# Altium project eBug2014-Parallella-Carrier-H.PrjPcb
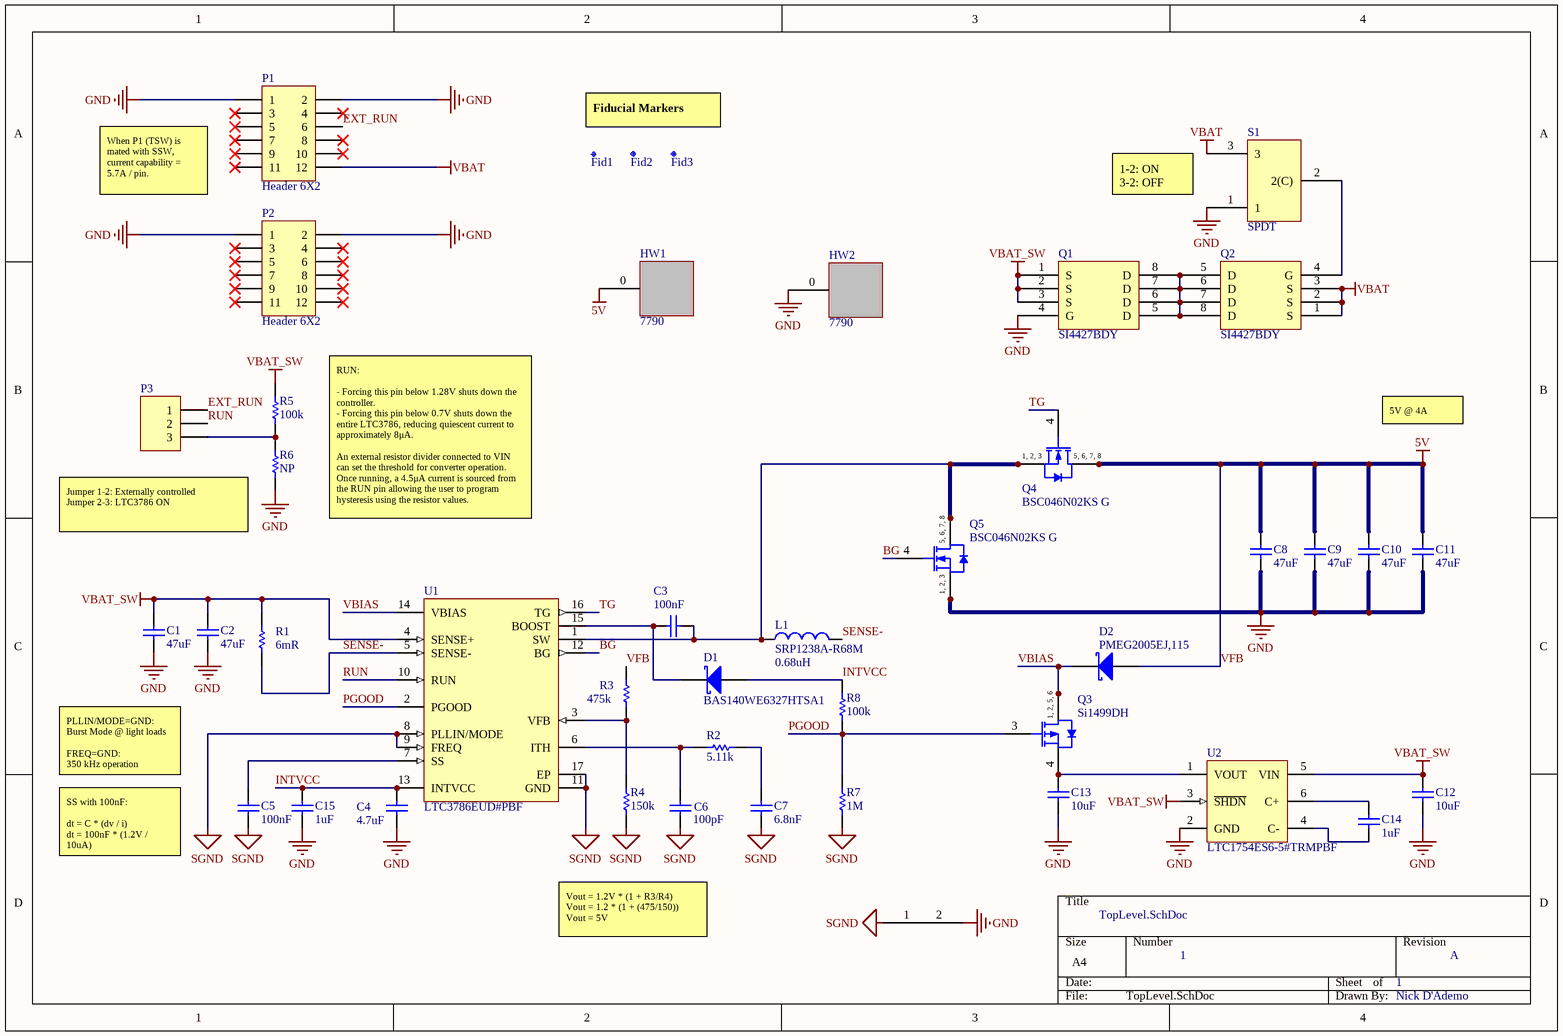
[diagram p0: TopLevel.SchDoc]
1 sheet, 43 parts. Net scope: global (net labels, ports and power ports of the same name join across sheets).
Board file: PCB.PcbDoc

## Sheet TopLevel.SchDoc
size A4; DrawnBy: Nick D'Ademo; DocumentNumber: 1; Revision: A; SheetNumber: 1; SheetTotal: 1

### Parts
C1  value 47uF  [CAPC3225N]  (hidden comment: Cap)
C2  value 47uF  [CAPC3225N]  (hidden comment: Cap)
C3  value 100nF  [CAPC1005N]  (hidden comment: Cap)
C4  value 4.7uF  [CAPC1005N]  (hidden comment: Cap)
C5  value 100nF  [CAPC1005N]  (hidden comment: Cap)
C6  value 100pF  [CAPC1005N]  (hidden comment: Cap)
C7  value 6.8nF  [CAPC1005N]  (hidden comment: Cap)
C8  value 47uF  [CAPC3225N]  (hidden comment: Cap)
C9  value 47uF  [CAPC3225N]  (hidden comment: Cap)
C10  value 47uF  [CAPC3225N]  (hidden comment: Cap)
C11  value 47uF  [CAPC3225N]  (hidden comment: Cap)
C12  value 10uF  [CAPC1005N]  (hidden comment: Cap)
C13  value 10uF  [CAPC1005N]  (hidden comment: Cap)
C14  value 1uF  [CAPC1005N]  (hidden comment: Cap)
C15  value 1uF  [CAPC1005N]  (hidden comment: Cap)
D1  BAS140WE6327HTSA1  [SOD323]
D2  PMEG2005EJ,115  [SOD323F]
Fid1  Fiducial mark  [Fiducial_BOTTOM]  (value not drawn)  (no BOM)
Fid2  Fiducial mark  [Fiducial_BOTTOM]  (value not drawn)  (no BOM)
Fid3  Fiducial mark  [Fiducial_BOTTOM]  (value not drawn)  (no BOM)
HW1  7790  [7790]
HW2  7790  [7790]
L1  SRP1238A-R68M  value 0.68uH  [SRP1238A]
NT1  NETTIE1  [NETTIE1]  (value not drawn)  (net tie, no BOM)
P1  Header 6X2  [TSW-106-05-G-D]
P2  Header 6X2  [TSW-106-05-G-D]
P3  (no value)  [TSW-103-05-T-S]
Q1  SI4427BDY  [SOIC127P600-8AN]
Q2  SI4427BDY  [SOIC127P600-8AN]
Q3  Si1499DH  [SOT363-6N]
Q4  BSC046N02KS G  [INF-PG-TDSON-8-1_V]
Q5  BSC046N02KS G  [INF-PG-TDSON-8-1_V]
R1  value 6mR  [RESC2012N]  (hidden comment: Res1)
R2  value 5.11k  [RESC1005N]  (hidden comment: Res1)
R3  value 475k  [RESC1005N]  (hidden comment: Res1)
R4  value 150k  [RESC1005N]  (hidden comment: Res1)
R5  value 100k  [RESC1005N]  (hidden comment: Res1)
R6  value NP  [RESC1005N]  (hidden comment: Res1)  (no BOM)
R7  value 1M  [RESC1005N]  (hidden comment: Res1)
R8  value 100k  [RESC1005N]  (hidden comment: Res1)
S1  SPDT  [CL-SB-12B-11T]
U1  LTC3786EUD#PBF  [LT-UD-16_N]
U2  LTC1754ES6-5#TRMPBF  [LT-S6-6-SOT-23_N]

### Nets
5V: C8.1 C9.1 C10.1 C11.1 D2.1(A) HW1.0 Q4.5(DRAIN) Q4.6(DRAIN) Q4.7(DRAIN) Q4.8(DRAIN) R3.1  [also labelled VFB]
GND: C1.2 C2.2 C4.2 C8.2 C9.2 C10.2 C11.2 C12.2 C13.2 C15.2 HW2.0 NT1.2 P1.1 P1.2 P2.1 P2.2 Q1.4(G) Q5.1(SOURCE) Q5.2(SOURCE) Q5.3(SOURCE) R6.2 S1.1 U2.2(GND)
SGND: C5.1 C6.2 C7.2 NT1.1 R4.2 R7.2 U1.8(PLLIN/MODE) U1.9(FREQ) U1.11(GND) U1.17(EP)
VBAT: P1.12 Q2.1(S) Q2.2(S) Q2.3(S) S1.3
VBAT_SW: C1.1 C2.1 C12.1 Q1.1(S) Q1.2(S) Q1.3(S) R1.2 R5.1 U1.4(SENSE+) U2.3(~{SHDN}) U2.5(VIN)
BG: Q5.4(GATE) U1.12(BG)
EXT_RUN: P1.6 P3.1
INTVCC: C4.1 C15.1 D1.1(A) R8.1 U1.13(INTVCC)
PGOOD: Q3.3(G) R7.1 R8.2 U1.2(PGOOD)
RUN: P3.2 U1.10(RUN)
SENSE-: L1.2 R1.1 U1.5(SENSE-)
TG: Q4.4(GATE) U1.16(TG)
VBIAS: D2.2(K) Q3.1(D) Q3.2(D) Q3.5(D) Q3.6(D) U1.14(VBIAS)
NetC3_1: C3.1 L1.1 Q4.1(SOURCE) Q4.2(SOURCE) Q4.3(SOURCE) Q5.5(DRAIN) Q5.6(DRAIN) Q5.7(DRAIN) Q5.8(DRAIN) U1.1(SW)
NetC3_2: C3.2 D1.2(K) U1.15(BOOST)
NetC5_2: C5.2 U1.7(SS)
NetC6_1: C6.1 R2.2 U1.6(ITH)
NetC7_1: C7.1 R2.1
NetC13_1: C13.1 Q3.4(S) U2.1(VOUT)
NetC14_1: C14.1 U2.6(C+)
NetC14_2: C14.2 U2.4(C-)
NetP3_3: P3.3 R5.2 R6.1
NetQ1_5: Q1.5(D) Q1.6(D) Q1.7(D) Q1.8(D) Q2.5(D) Q2.6(D) Q2.7(D) Q2.8(D)
NetQ2_4: Q2.4(G) S1.2(2(C))
NetR3_2: R3.2 R4.1 U1.3(VFB)

Not connected (* = marked no-connect by the designer): P1 3* 4* 5* 7* 8* 9* 10* 11*; P2 3* 4* 5* 6* 7* 8* 9* 10* 11* 12*

### Notes on the sheet
- Fiducial Markers
- When P1 (TSW) is mated with SSW, current capability = 5.7A / pin.
- 1-2: ON
  3-2: OFF
- 5V @ 4A
- RUN:
  - Forcing this pin below 1.28V shuts down the controller.
  - Forcing this pin below 0.7V shuts down the entire LTC3786, reducing quiescent current to approximately 8μA.
  An external resistor divider connected to VIN can set the threshold for converter operation. Once running, a 4.5μA current is sourced from the RUN pin allowing the user to program hysteresis using the resistor values.
- Jumper 1-2: Externally controlled
  Jumper 2-3: LTC3786 ON
- PLLIN/MODE=GND:
  Burst Mode @ light loads
  FREQ=GND:
  350 kHz operation
- SS with 100nF:
  dt = C * (dv / i)
  dt = 100nF * (1.2V / 10uA)
  dt = 12 ms
- Vout = 1.2V * (1 + R3/R4)
  Vout = 1.2 * (1 + (475/150))
  Vout = 5V
- (in symbol BSC046N02KS G) 1, 2, 3; 5, 6, 7, 8
- (in symbol Si1499DH) 1, 2, 5, 6

### Library data of the parts
C1 C2 C8-C11 = Cap: MURATA - GRM32ER71A476KE15L - CAP CER 47UF 10V X7R 1210; Published: 8-Jun-2000; LatestRevisionDate: 17-Jul-2002; LatestRevisionNote: Re-released for DXP Platform.; PackageReference: RAD-0.3; Publisher: Altium Limited; PackageDescription: Radial Cap, Thru-Hole; 2 Leads; 0.3 in Pin Spacing
C3 C5 = Cap: TDK - C1005X7R1C104K050BC - CAP CER 0.1UF 16V X7R 0402; Published: 8-Jun-2000; LatestRevisionDate: 17-Jul-2002; LatestRevisionNote: Re-released for DXP Platform.; PackageReference: RAD-0.3; Publisher: Altium Limited; PackageDescription: Radial Cap, Thru-Hole; 2 Leads; 0.3 in Pin Spacing
C4 = Cap: TDK - C1005X5R1A475K050BC - CAP CER 4.7UF 10V X5R 0402; Published: 8-Jun-2000; LatestRevisionDate: 17-Jul-2002; LatestRevisionNote: Re-released for DXP Platform.; PackageReference: RAD-0.3; Publisher: Altium Limited; PackageDescription: Radial Cap, Thru-Hole; 2 Leads; 0.3 in Pin Spacing
C6 = Cap: KEMET - C0402C101J5GACTU -  CAP CER 100PF 50V NP0 0402; Published: 8-Jun-2000; LatestRevisionDate: 17-Jul-2002; LatestRevisionNote: Re-released for DXP Platform.; PackageReference: RAD-0.3; Publisher: Altium Limited; PackageDescription: Radial Cap, Thru-Hole; 2 Leads; 0.3 in Pin Spacing
C7 = Cap: MURATA - GRM155R71E682KA01D - CAP CER 6800PF 25V X7R 0402; Published: 8-Jun-2000; LatestRevisionDate: 17-Jul-2002; LatestRevisionNote: Re-released for DXP Platform.; PackageReference: RAD-0.3; Publisher: Altium Limited; PackageDescription: Radial Cap, Thru-Hole; 2 Leads; 0.3 in Pin Spacing
C12 C13 = Cap: TDK - C1005X5R0J106M050BC - CAP CER 10UF 6.3V X5R 0402; Published: 8-Jun-2000; LatestRevisionDate: 17-Jul-2002; LatestRevisionNote: Re-released for DXP Platform.; PackageReference: RAD-0.3; Publisher: Altium Limited; PackageDescription: Radial Cap, Thru-Hole; 2 Leads; 0.3 in Pin Spacing
C14 C15 = Cap: MURATA - GRM155R61A105KE15D - CAP CER 1UF 10V X5R 0402; Published: 8-Jun-2000; LatestRevisionDate: 17-Jul-2002; LatestRevisionNote: Re-released for DXP Platform.; PackageReference: RAD-0.3; Publisher: Altium Limited; PackageDescription: Radial Cap, Thru-Hole; 2 Leads; 0.3 in Pin Spacing
D1 = D Schottky: INFINEON TECHNOLOGIES - BAS140WE6327HTSA1 - DIODE SCHOTTKY 40V 120MA SOD323; Published: 8-Jun-2000; LatestRevisionDate: 17-Jul-2002; LatestRevisionNote: Re-released for DXP Platform.; PackageReference: SMB; Publisher: Altium Limited; PackageDescription: DO-214-AA/SMB; 2 C-Bend Leads; Body 5.3 x 3.6 mm, inc. leads (LxW); Code_JEDEC: DO-214-AA
D2 = D Schottky: NXP SEMICONDUCTORS - PMEG2005EJ,115 - DIODE SCHOTTKY 20V 500MA SOD323F; Published: 8-Jun-2000; LatestRevisionDate: 17-Jul-2002; LatestRevisionNote: Re-released for DXP Platform.; PackageReference: SMB; Publisher: Altium Limited; PackageDescription: DO-214-AA/SMB; 2 C-Bend Leads; Body 5.3 x 3.6 mm, inc. leads (LxW); Code_JEDEC: DO-214-AA
Fid1-Fid3 = Fiducial: Part Number: Fid-Mark; Artikkelnr Noca: N.A.; Manufacturer: *; Manufacturer Part Number: *; Datasheet: *; Footprint: Fiducial; LatestRevisionDate: 2009-12-12; Pin Count: 1; Publisher: Nordic Semiconductor; Published: 2009-12-12; Value: *; Note: *; Supplier: *; Supplier part number: *; 2nd source Supplier: *; 2nd source part number: *
HW1 HW2 = 7790: KEYSTONE ELECTRONICS - 7790 - TERM PCB SNAP-IN HORZ M3 THREAD
L1 = Inductor: BOURNS INC - SRP1238A-R68M - FIXED IND 680NH 28A 2.5 MOHM SMD; Code_IEC: 1005; Published: 8-Jun-2000; LatestRevisionDate: 29-May-2009; LatestRevisionNote: IPC-7351 Footprint Added.; PackageReference: 0402-A; Publisher: Altium Limited; PackageDescription: Chip Inductor; Code_JEITA: 0402
P1 P2 = Header 6X2: SAMTEC - TSW-106-05-G-D - 12 Positions Header, Unshrouded Connector 0.100" (2.54mm) Through Hole Gold; LatestRevisionDate: 17-Jul-2002; LatestRevisionNote: Re-released for DXP Platform.; Publisher: Altium Limited
P3 = Header 3: SAMTEC - TSW-103-05-T-S - 3 Positions Header, Unshrouded Connector 0.100" (2.54mm) Through Hole Tin; LatestRevisionDate: 17-Jul-2002; LatestRevisionNote: Re-released for DXP Platform.; Publisher: Altium Limited
Q1 Q2 = SI4427BDY: VISHAY SILICONIX - SI4427BDY-T1-E3 - MOSFET P-CH 30V 9.7A 8-SOIC
Q3 = Si1499DH: VISHAY SILICONIX - SI1499DH-T1-E3 - MOSFET P-CH 8V 1.6A SC70-6; Published: 8-Jun-2000; LatestRevisionDate: 17-Jul-2002; LatestRevisionNote: Re-released for DXP Platform.; DatasheetVersion: 23-Nov-1998; PackageVersion: Aug-1998; PackageReference: TSOP-6; Publisher: Altium Limited; PackageDescription: SOT-457/SC-74; 6 Leads; Body 3.1 x 3 mm, inc. leads (LxW max); ComponentLink1Description: Manufacturer Link; ComponentLink1URL: http://www.vishay.com/; ComponentLink2Description: Datasheet; ComponentLink2URL: http://www.vishay.com/docs/71839/71839.pdf
Q4 Q5 = BSC046N02KS G: INFINEON - BSC046N02KS G - N-Channel OptiMOS 2 Power-Transistor, 20 V VDS, 80 A ID, -55 to 150 degC, PG-TDSON-8-1, Reel, Green; Green: TRUE; ID (max): 80 A; IDpuls (max): 200 A; Polarity: N; Ptot (max): 48 W; QG: 21 nC; RDS (on) (max) (@4.5V): 4.6 mOhm; Rth: 2.6 K/W; RthJA (max): 62 K/W; VDS (max): 20 V; VGS(th) (max): 1.2 V; VGS(th) (min): 0.7 V; DatasheetVersion: Rev. 1.06; PackageReference: PG-TDSON-8-1; PackageDescription: 8-Pin Plastic (Green) Thin Dual Small Outline Non-Leaded Package, 5.15 x 5.9 mm Body, 1.27 mm Pitch; Supplier 1: Mouser; Supplier Part Number 1: 726-BSC046N02KSG; Supplier 2: Newark; Supplier Part Number 2: 60R2491; Supplier 3: Farnell; Supplier Part Number 3: 1775442; Supplier 4: Digi-Key; Supplier Part Number 4: BSC046N02KS GTR-ND; Supplier 5: Digi-Key; Supplier Part Number 5: BSC046N02KS GCT-ND; Supplier 6: Digi-Key; Supplier Part Number 6: BSC046N02KS GDKR-ND; Halogen-free: TRUE; Packing: Reel; RthJC (max): 2.6 K/W; Mounting Technology: Surface Mount; Manufacturer: Infineon; PartNumber: BSC046N02KS G; ComponentLink1Description: Manufacturer URL; ComponentLink1URL: http://www.infineon.com/; ComponentLink2Description: Datasheet; ComponentLink2URL: http://www.infineon.com/dgdl/BSC046N02KS+G+Rev16.pdf?folderId=db3a3043163797a6011637c252b10018&fileId=db3a3043163797a6011637c34414001c; ComponentLink3Description: Package Specification; ComponentLink3URL: http://www.infineon.com/cms/packages/SMD_-_Surface_Mounted_Devices/P-PG-TDSON/P-PG-TDSON-08-01x_2x_3.html?__locale=en
R1 = Res1: VISHAY DALE - WSLP08056L000FEA18 - RES SMD 0.006 OHM 1% 1W 0805; Published: 8-Jun-2000; LatestRevisionDate: 17-Jul-2002; LatestRevisionNote: Re-released for DXP Platform.; PackageReference: AXIAL-0.3; Publisher: Altium Limited; PackageDescription: Axial Device, Thru-Hole; 2 Leads; 0.3 in Pin Spacing
R2 = Res1: PANASONIC - ERJ-2RKF5111X - RES SMD 5.11K OHM 1% 1/10W 0402; Published: 8-Jun-2000; LatestRevisionDate: 17-Jul-2002; LatestRevisionNote: Re-released for DXP Platform.; PackageReference: AXIAL-0.3; Publisher: Altium Limited; PackageDescription: Axial Device, Thru-Hole; 2 Leads; 0.3 in Pin Spacing
R3 = Res1: PANASONIC - ERJ-2RKF4753X - RES SMD 475K OHM 1% 1/10W 0402; Published: 8-Jun-2000; LatestRevisionDate: 17-Jul-2002; LatestRevisionNote: Re-released for DXP Platform.; PackageReference: AXIAL-0.3; Publisher: Altium Limited; PackageDescription: Axial Device, Thru-Hole; 2 Leads; 0.3 in Pin Spacing
R4 = Res1: PANASONIC - ERJ-2RKF1503X - RES SMD 150K OHM 1% 1/10W 0402; Published: 8-Jun-2000; LatestRevisionDate: 17-Jul-2002; LatestRevisionNote: Re-released for DXP Platform.; PackageReference: AXIAL-0.3; Publisher: Altium Limited; PackageDescription: Axial Device, Thru-Hole; 2 Leads; 0.3 in Pin Spacing
R5 R8 = Res1: PANASONIC - ERJ-2RKF1003X - RES SMD 100K OHM 1% 1/10W 0402; Published: 8-Jun-2000; LatestRevisionDate: 17-Jul-2002; LatestRevisionNote: Re-released for DXP Platform.; PackageReference: AXIAL-0.3; Publisher: Altium Limited; PackageDescription: Axial Device, Thru-Hole; 2 Leads; 0.3 in Pin Spacing
R6 = Res1: Resistor; Published: 8-Jun-2000; LatestRevisionDate: 17-Jul-2002; LatestRevisionNote: Re-released for DXP Platform.; PackageReference: AXIAL-0.3; Publisher: Altium Limited; PackageDescription: Axial Device, Thru-Hole; 2 Leads; 0.3 in Pin Spacing
R7 = Res1: PANASONIC - ERJ-2RKF1004X - RES SMD 1M OHM 1% 1/10W 0402; Published: 8-Jun-2000; LatestRevisionDate: 17-Jul-2002; LatestRevisionNote: Re-released for DXP Platform.; PackageReference: AXIAL-0.3; Publisher: Altium Limited; PackageDescription: Axial Device, Thru-Hole; 2 Leads; 0.3 in Pin Spacing
S1 = CL-SB-12B-01T: COPAL ELECTRONICS INC - CL-SB-12B-11T - SWITCH SLIDE SPDT 200MA 12V
U1 = LTC3786EUD#PBF: LINEAR TECH - LTC3786EUD#PBF - Sync Boost Controller, Low 55 uA IQ, 16-pin QFN (UD-16), -40 to 125 degC, Pb-Free; Manufacturer: Linear Technology; Frequency Sync Range: 75kHz - 850kHz; Number of Outputs: 1; DatasheetVersion: Rev. A; PackageVersion: Jun-10; PackageReference: UD-16; PackageDescription: 16-Pin Plastic QFN, Body 3 x 3 mm, Pitch 0.5 mm; Supplier 1: Digi-Key; Supplier Part Number 1: LTC3786EUD#PBF-ND; Supplier 2: Farnell; Supplier Part Number 2: 2295141; Supplier 3: Newark; Supplier Part Number 3: 13T3895; RoHS: TRUE; Mounting Technology: Surface Mount; Code_JEDEC: MO-220; PartNumber: LTC3786EUD#PBF; ComponentLink1Description: Manufacturer URL; ComponentLink1URL: http://www.linear.com/; ComponentLink2Description: Datasheet; ComponentLink2URL: http://cds.linear.com/docs/en/datasheet/3786fa.pdf; ComponentLink3Description: Package Specification; ComponentLink3URL: http://cds.linear.com/docs/en/packaging/QFN_16_05-08-1691.pdf
U2 = LTC1754ES6-5#TRMPBF: LINEAR TECH - LTC1754ES6-5#TRMPBF - Micropower, Regulated Charge Pump with Shutdown, 2.7 to 5.5 V Vin, 5 V Vout, 6-pin SOT23 (S6-6), -40 to 85 degC, Pb-Free, Mini Tape and Reel; Manufacturer: Linear Technology; Frequency(kHz): 700; Ishutdown(uA): 0.01; Isupply(mA): 0.013; Max Iout(mA): 40; Vin Max(V): 5.5; Vin Min(V): 2.7; Voutput: 5V; PackageVersion: Aug-07; PackageReference: S6-6; PackageDescription: 6-Pin Plastic SOT-23, Body 1.625 x 2.9 mm, Pitch 0.95 mm; Supplier 1: Digi-Key; Supplier Part Number 1: LTC1754ES6-5#TRMPBFTR-ND; Supplier 2: Digi-Key; Supplier Part Number 2: LTC1754ES6-5#TRMPBFCT-ND; Supplier 3: Digi-Key; Supplier Part Number 3: LTC1754ES6-5#TRMPBFDKR-ND; Supplier 4: Farnell; Supplier Part Number 4: 1663858; Supplier 5: Farnell; Supplier Part Number 5: 1663858RL; Supplier 6: Newark; Supplier Part Number 6: 56M3715; Packing: Mini Tape and Reel; RoHS: TRUE; Mounting Technology: Surface Mount; PartNumber: LTC1754ES6-5#TRMPBF; ComponentLink1Description: Manufacturer URL; ComponentLink1URL: http://www.linear.com/; ComponentLink2Description: Datasheet; ComponentLink2URL: http://cds.linear.com/docs/en/datasheet/175435f.pdf; ComponentLink3Description: Package Specification; ComponentLink3URL: http://cds.linear.com/docs/en/datasheet/175435f.pdf